# Altium schematic sheet P05_PWM-DAC.SchDoc
size 301 x 239 mm
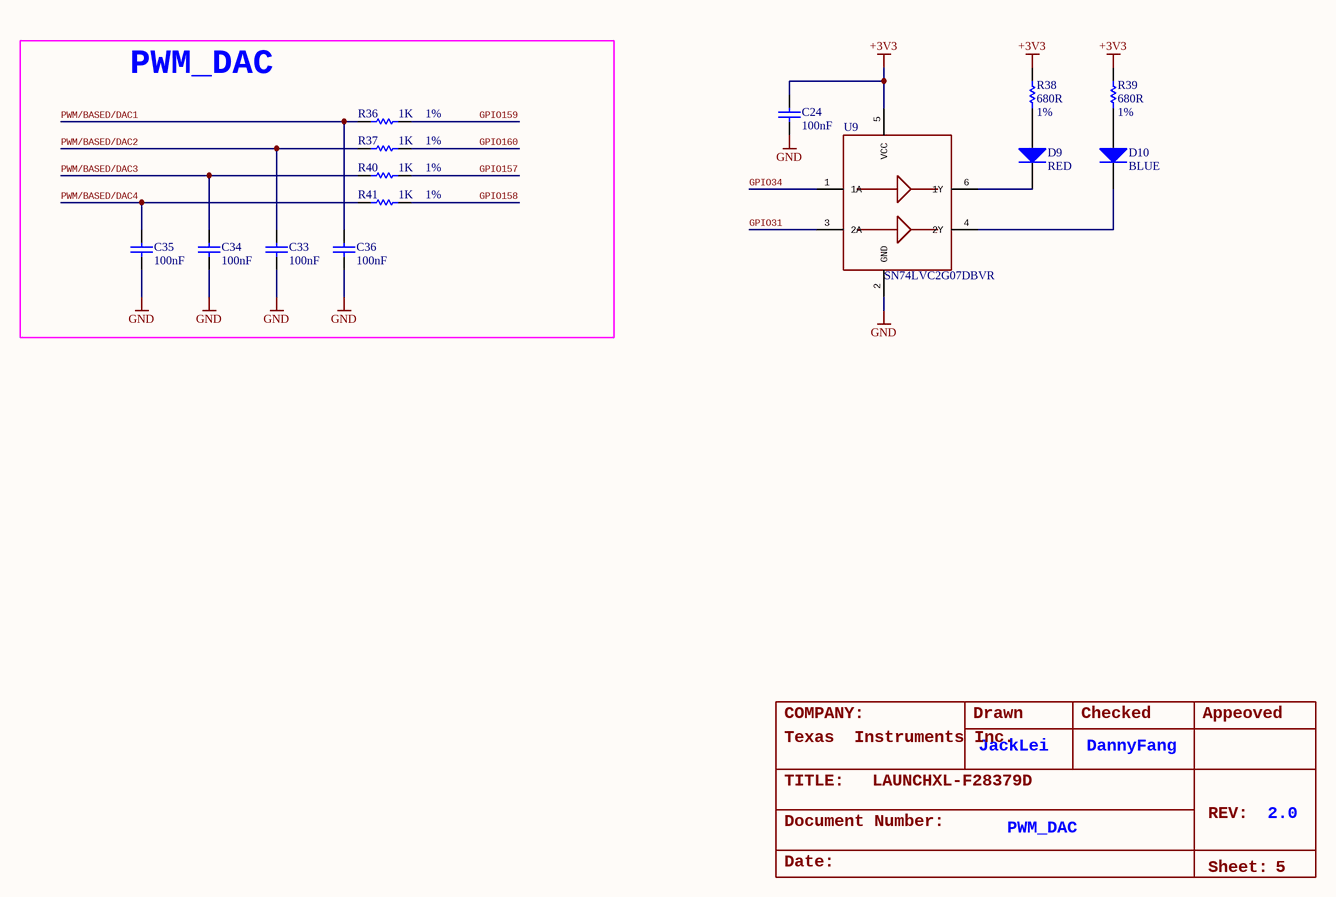
[diagram p0: P05_PWM-DAC.SchDoc]

## Parts
C24  100nF  [C0402]
C33  100nF  [C0402]
C34  100nF  [C0402]
C35  100nF  [C0402]
C36  100nF  [C0402]
D9  value RED  [D0805]  (hidden comment: 150080SS75000)
D10  value BLUE  [D0805]  (hidden comment: 150080BS75000)
R36  Rating: 1%  [R0402]  (hidden comment: 1K)
R37  Rating: 1%  [R0402]  (hidden comment: 1K)
R38  Rating: 1%  [R0402]  (hidden comment: 680R)
R39  Rating: 1%  [R0402]  (hidden comment: 680R)
R40  Rating: 1%  [R0402]  (hidden comment: 1K)
R41  Rating: 1%  [R0402]  (hidden comment: 1K)
U9  SN74LVC2G07DBVR  [SOT23-6]

## Blocks framed on the sheet
PWM_DAC: C33-C36 R36 R37 R40 R41

## Nets
+3V3: C24.2 R38.2 R39.2 U9.5(VCC)
GND: C24.1 C33.1 C34.1 C35.1 C36.1 U9.2(GND)
GPIO31: U9.3(2A)
GPIO34: U9.1(1A)
GPIO157: R40.1
GPIO158: R41.1
GPIO159: R36.1
GPIO160: R37.1
PWM/BASED/DAC1: C36.2 R36.2
PWM/BASED/DAC2: C33.2 R37.2
PWM/BASED/DAC3: C34.2 R40.2
PWM/BASED/DAC4: C35.2 R41.2
NetD9_1: D9.1 U9.6(1Y)
NetD9_2: D9.2 R38.1
NetD10_1: D10.1 U9.4(2Y)
NetD10_2: D10.2 R39.1

## Notes on the sheet
- COMPANY:
- Texas
  Instruments Inc.
- Drawn
- JackLei
- Checked
- DannyFang
- Appeoved
- TITLE:
- LAUNCHXL-F28379D
- REV:
- 2.0
- Date:
- Document Number:
- PWM_DAC
- Sheet:
- 5
- 1
- 2
- 3
- 4
- 6
- A
- B
- C
- D
- E

## Library data of the parts
C24 C33-C36 = 1004001100187: CAP,100NF(0.1uf),+/-10%,X5R,10V,SMD0402; Manufacturer: MURATA; Manufacturer Part Number: GRM155R61A104KA01D; Rating: 10%; Embest PN: 1004001100187; Value: 100nF; Part Type: Ceramic Capacitor
D9 = 1006001100168: LED, SUPPER RED ,630NM,30mA, SMD,0805; Manufacturer: WURTH; Embest PN: 1006001100168; Part Type: LED; Manufacturer Part Number: 150080SS75000
D10 = 1006001100167: LED, BLUE ,470NM, 30mA,SMD,0805; Manufacturer: WURTH; Embest PN: 1006001100167; Part Type: LED; Manufacturer Part Number: 150080BS75000
R36 R37 R40 R41 = 1003001100034: RES,1K,+/-1%,1/16W,SMD0402; Manufacturer: YAGEO; Manufacturer Part Number: RC0402FR-071KL; Embest PN: 1003001100034; Value: 1K; Part Type: Thick film Resistor
R38 R39 = 1003001100490: RES,680R,+/-1%,1/16W,SMD0402; Manufacturer: YAGEO; Manufacturer Part Number: RC0402FR-07680RL; Embest PN: 1003001100490; Value: 680R; Part Type: Thick film Resistor
U9 = 1002008100102C: Buffer/Driver 2-CH Non-Inverting Open Drain CMOS 6-Pin SOT-23 T/R,CUSTOMER SUPPLY; Manufacturer: TI; Embest PN: 1002008100102C; Value: SN74LVC2G07DBVR; Part Type: Logic; Manufacturer Part Number: SN74LVC2G07DBVR